# EAGLE schematic board_0.5v (EAGLE 7.7.0)
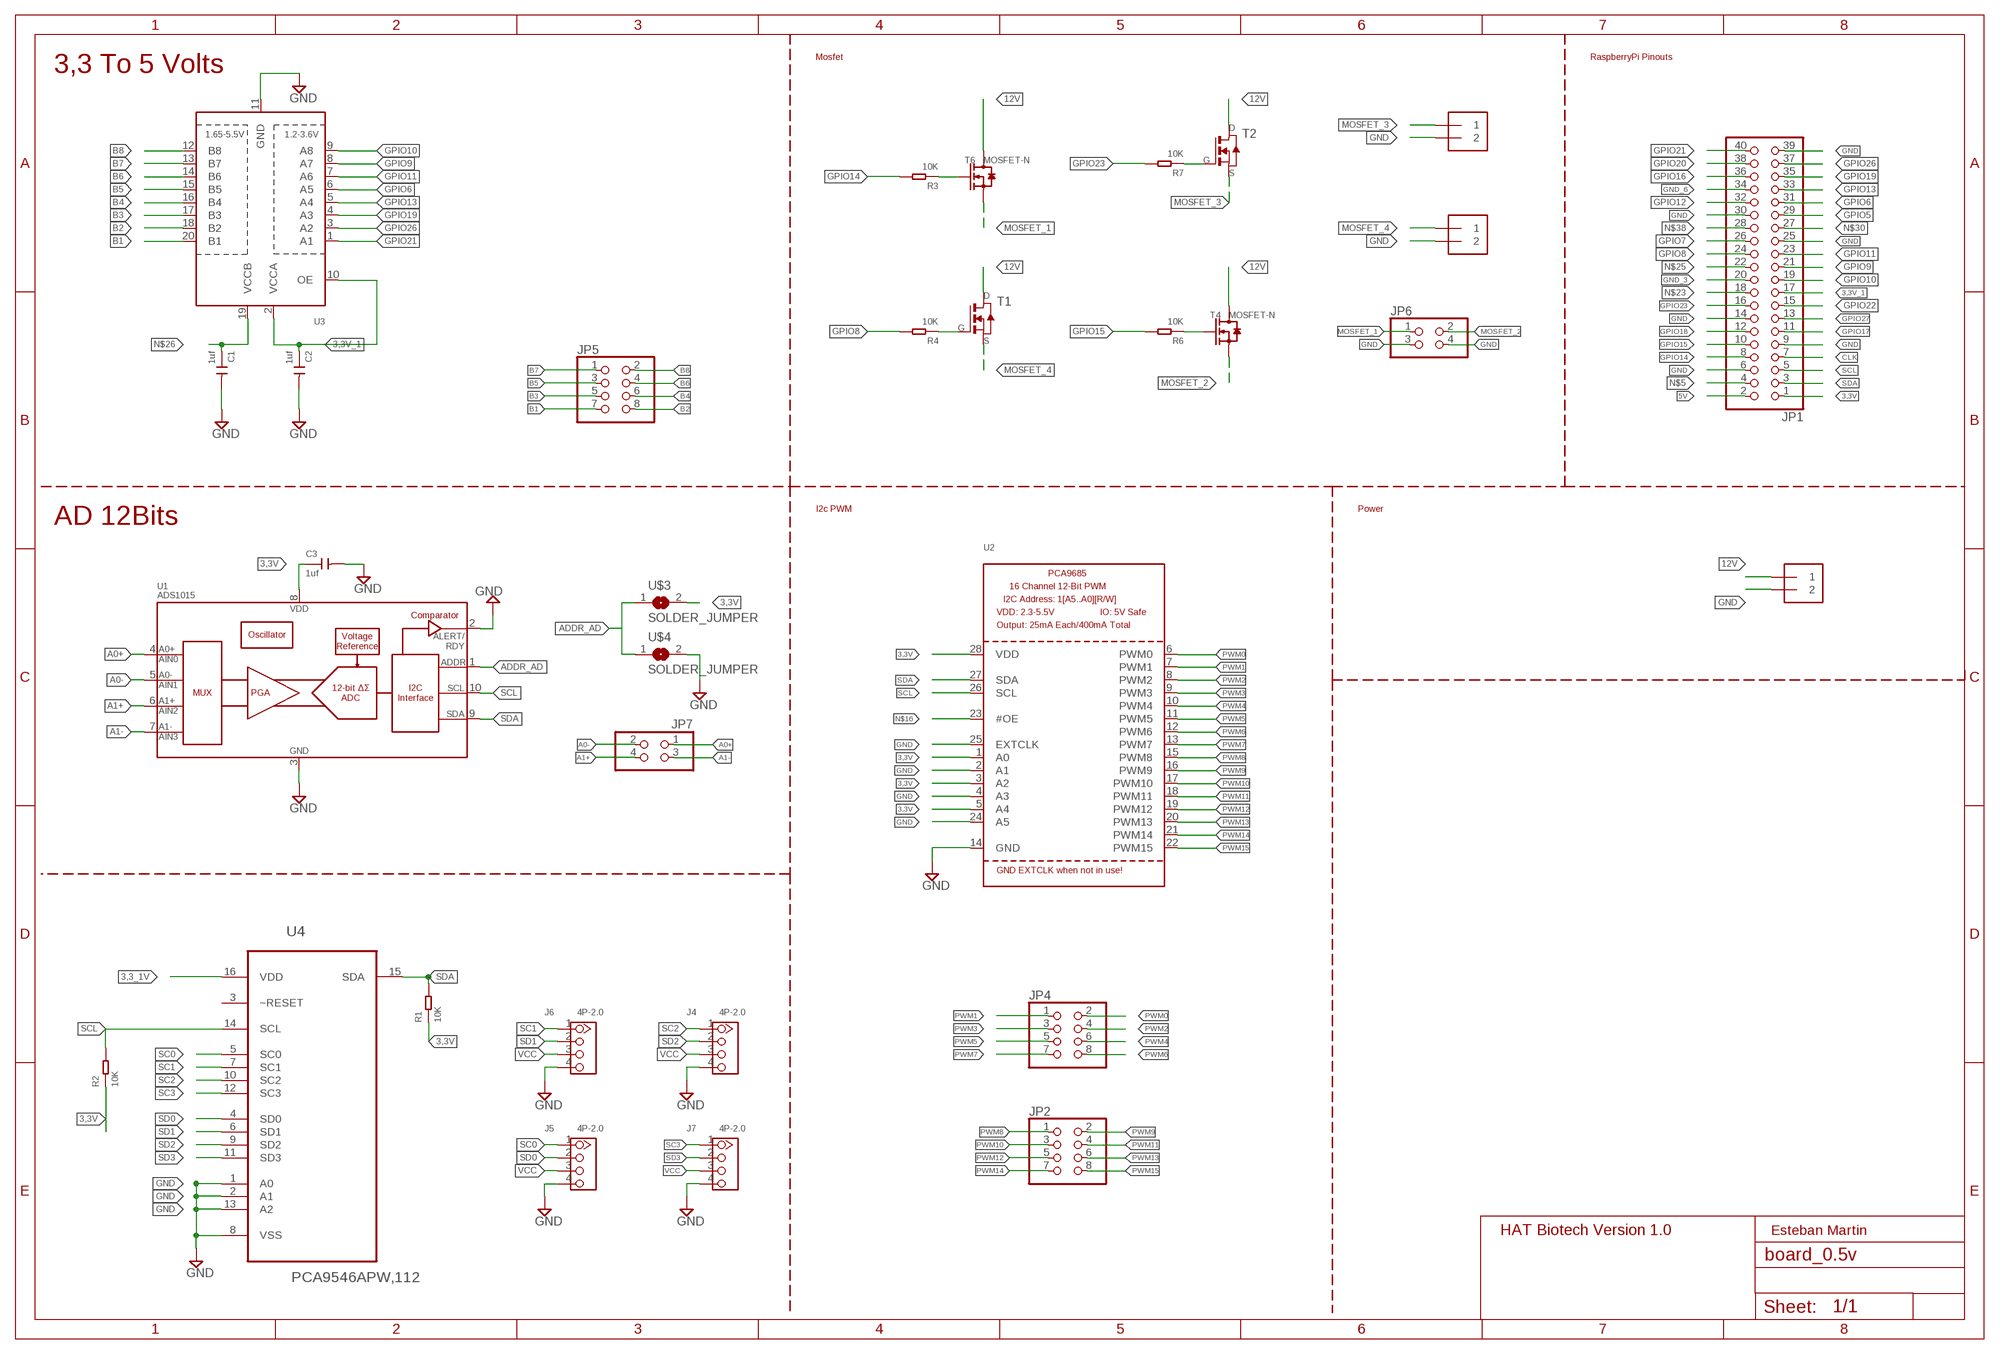
[diagram p0: schematic, sheet 1]

## Parts
C1  1uf  CERAMIC-1UF-25V-10%-X7R(0805)  [C0805]
C2  1uf  CERAMIC-1UF-25V-10%-X7R(0805)  [C0805]
C3  1uf  CERAMIC-1UF-25V-10%-X7R(0805)  [C0805]
J1  1X2-3.5MM  [1X2-3.5MM]
J2  1X2-3.5MM  [1X2-3.5MM]
J3  1X2-3.5MM  [1X2-3.5MM]
J4  4P-2.0  GROVE-CONNECTOR-DIP(4P-2.0)  [HW4-2.0]
J5  4P-2.0  GROVE-CONNECTOR-DIP(4P-2.0)  [HW4-2.0]
J6  4P-2.0  GROVE-CONNECTOR-DIP(4P-2.0)  [HW4-2.0]
J7  4P-2.0  GROVE-CONNECTOR-DIP(4P-2.0)  [HW4-2.0]
JP1  PINHD-2X20  [2X20]
JP2  PINHD-2X4  [2X04]
JP4  PINHD-2X4  [2X04]
JP5  PINHD-2X4  [2X04]
JP6  PINHD-2X2  [2X02]
JP7  PINHD-2X2  [2X02]
R1  10K  SMD-RES-10K-1%-1/8W(0805)  [R0805]
R2  10K  SMD-RES-10K-1%-1/8W(0805)  [R0805]
R3  10K  SMD-RES-10K-1%-1/8W(0805)  [R0805]
R4  10K  SMD-RES-10K-1%-1/8W(0805)  [R0805]
R6  10K  SMD-RES-10K-1%-1/8W(0805)  [R0805]
R7  10K  SMD-RES-10K-1%-1/8W(0805)  [R0805]
T1  NMOSFETTO252  [TO252]
T2  NMOSFETTO252  [TO252]
T4  MOSFET-N  [SOT-23]
T6  MOSFET-N  [SOT-23]
U1  ADS1015  [MSOP10]
U2  PCA9685  [TSSOP28]
U3  TXB0108PWR  [TSSOP20]
U4  PCA9546APW,112  [SOP65P640X110-16N]
U$3  SOLDER_JUMPER  [SJFAB]
U$4  SOLDER_JUMPER  [SJFAB]

## Nets
3,3_1V: U4.16(VDD)
3,3V: C3.1 JP1.1 R1.1 R2.1 U1.8(VDD) U2.1(A0) U2.3(A2) U2.5(A4) U2.28(VDD) U$3.2
3,3V_1: C2.1 JP1.17 U3.2(VCCA) U3.10(OE)
5V: JP1.2
12V: J2.1 T1.3(D) T2.3(D) T4.3(D) T6.3(D)
A0+: JP7.1 U1.4(AIN0)
A0-: JP7.2 U1.5(AIN1)
A1+: JP7.4 U1.6(AIN2)
A1-: JP7.3 U1.7(AIN3)
ADDR_AD: U1.1(ADDR) U$3.1 U$4.1
B1: JP5.7 U3.20(B1)
B2: JP5.8 U3.18(B2)
B3: JP5.5 U3.17(B3)
B4: JP5.6 U3.16(B4)
B5: JP5.3 U3.15(B5)
B6: JP5.4 U3.14(B6)
B7: JP5.1 U3.13(B7)
B8: JP5.2 U3.12(B8)
CLK: JP1.7
GND: C1.2 C2.2 C3.2 J1.2 J2.2 J3.2 J4.4 J5.4 J6.4 J7.4 JP1.6 JP1.9 JP1.14 JP1.25 JP1.30 JP1.39 JP6.3 JP6.4 U1.2(ALERT/RDY) U1.3(VSS) U2.2(A1) U2.4(A3) U2.14(GND) U2.24(A5) U2.25(EXTCLK) U3.11(GND) U4.1(A0) U4.2(A1) U4.8(VSS) U4.13(A2) U$4.2
GND_3: JP1.20
GND_6: JP1.34
GPIO5: JP1.29
GPIO6: JP1.31 U3.6(A5)
GPIO7: JP1.26
GPIO8: JP1.24 R4.2
GPIO9: JP1.21 U3.8(A7)
GPIO10: JP1.19 U3.9(A8)
GPIO11: JP1.23 U3.7(A6)
GPIO12: JP1.32
GPIO13: JP1.33 U3.5(A4)
GPIO14: JP1.8 R3.2
GPIO15: JP1.10 R6.2
GPIO16: JP1.36
GPIO17: JP1.11
GPIO18: JP1.12
GPIO19: JP1.35 U3.4(A3)
GPIO20: JP1.38
GPIO21: JP1.40 U3.1(A1)
GPIO22: JP1.15
GPIO23: JP1.16 R7.2
GPIO26: JP1.37 U3.3(A2)
GPIO27: JP1.13
MOSFET_1: JP6.1 T6.2(S)
MOSFET_2: JP6.2 T4.2(S)
MOSFET_3: J1.1 T2.2(S)
MOSFET_4: J3.1 T1.2(S)
N$5: JP1.4
N$6: R3.1 T6.1(G)
N$9: R4.1 T1.1(G)
N$10: R6.1 T4.1(G)
N$11: R7.1 T2.1(G)
N$16: U2.23(#OE)
N$23: JP1.18
N$25: JP1.22
N$26: C1.1 U3.19(VCCB)
N$30: JP1.27
N$38: JP1.28
PWM0: JP4.2 U2.6(PWM0)
PWM1: JP4.1 U2.7(PWM1)
PWM2: JP4.4 U2.8(PWM2)
PWM3: JP4.3 U2.9(PWM3)
PWM4: JP4.6 U2.10(PWM4)
PWM5: JP4.5 U2.11(PWM5)
PWM6: JP4.8 U2.12(PWM6)
PWM7: JP4.7 U2.13(PWM7)
PWM8: JP2.1 U2.15(PWM8)
PWM9: JP2.2 U2.16(PWM9)
PWM10: JP2.3 U2.17(PWM10)
PWM11: JP2.4 U2.18(PWM11)
PWM12: JP2.5 U2.19(PWM12)
PWM13: JP2.6 U2.20(PWM13)
PWM14: JP2.7 U2.21(PWM14)
PWM15: JP2.8 U2.22(PWM15)
SC0: J5.1 U4.5(SC0)
SC1: J6.1 U4.7(SC1)
SC2: J4.1 U4.10(SC2)
SC3: J7.1 U4.12(SC3)
SCL: JP1.5 R2.2 U1.10(SCL) U2.26(SCL) U4.14(SCL)
SD0: J5.2 U4.4(SD0)
SD1: J6.2 U4.6(SD1)
SD2: J4.2 U4.9(SD2)
SD3: J7.2 U4.11(SD3)
SDA: JP1.3 R1.2 U1.9(SDA) U2.27(SDA) U4.15(SDA)
VCC: J4.3 J5.3 J6.3 J7.3
Unconnected: U4.3(~RESET)

## Notes on the sheet
- Mosfet | RaspberryPi Pinouts
- 3,3 To 5 Volts
- I2c PWM | Power
- AD 12Bits
- HAT Biotech Version 1.0 | Esteban Martin

## Library data of the parts
C1-C3 = Seeed-OPL-Capacitor:CERAMIC-1UF-25V-10%-X7R(0805): 302010179; MPN: CC0805KKX7R8BB105
J1-J3 = adafruit:1X2: 3.5mm Terminal block http://www.ladyada.net/library/pcb/eaglelibrary.html
J4-J7 = Seeed-OPL-Connector:GROVE-CONNECTOR-DIP(4P-2.0): 320110033
JP1 = adafruit:PINHD-2X20: PIN HEADER
JP2 JP4 JP5 = adafruit:PINHD-2X4: PIN HEADER
JP6 JP7 = pinhead:PINHD-2X2: PIN HEADER
R1-R4 R6 R7 = Seeed-OPL-Resistor:SMD-RES-10K-1%-1/8W(0805): 301010361; MPN: RC0805FR-0710KL
T1 T2 = fab_2:NMOSFET: MOS FET
T4 T6 = Seeed-OPL-Transistor:MOSFET-N
U1 = SparkFun-IC-Conversion:ADS1015: ADS1015 12-BIT ADC 12-Bit Del-Sig ADC Four single-ended inputs or two differential inputs Internal PGA I2C interface 2.0-5.5V SparkFun Products SparkFun Block for Intel Edison - ADC <https://www.sparkfun.com/products/13770> (DEV-13770); PROD_ID: IC-12270
U2 = adafruit:PCA9685: PCA9685 - 16 Channel 12-Bit I2C PWM Controller 5.0V tolerant 16 channel, 12-bit I2C PWM controller with 25mA per output (max. 400mA total) Digikey: 568-5931-1-ND
U3 = adafruit:TXB0108PWR: 8-Bit Bi-Directional Level Shifter 1.2V-3.6V (VCCA) to 1.65V-5.5V (VCCB) bi-directional level shifter with auto direction sensing. Max data rate - VCCA 1.8V: 20Mbps (50ns), VCCA 3.3V: 100Mbps (10ns) Digikey: 296-21527-1-ND
U4 = NXP_By_element14_Batch_1:PCA9546APW,112: 4-channel I2C-bus switch with reset; MPN: PCA9546APW,112; OC_FARNELL: 1831208; OC_NEWARK: 70R6610; PACKAGE: TSSOP-16; SUPPLIER: NXP
U$3 U$4 = fab:SOLDER_JUMPER